# Altium project PCB_Project3.PrjPcb
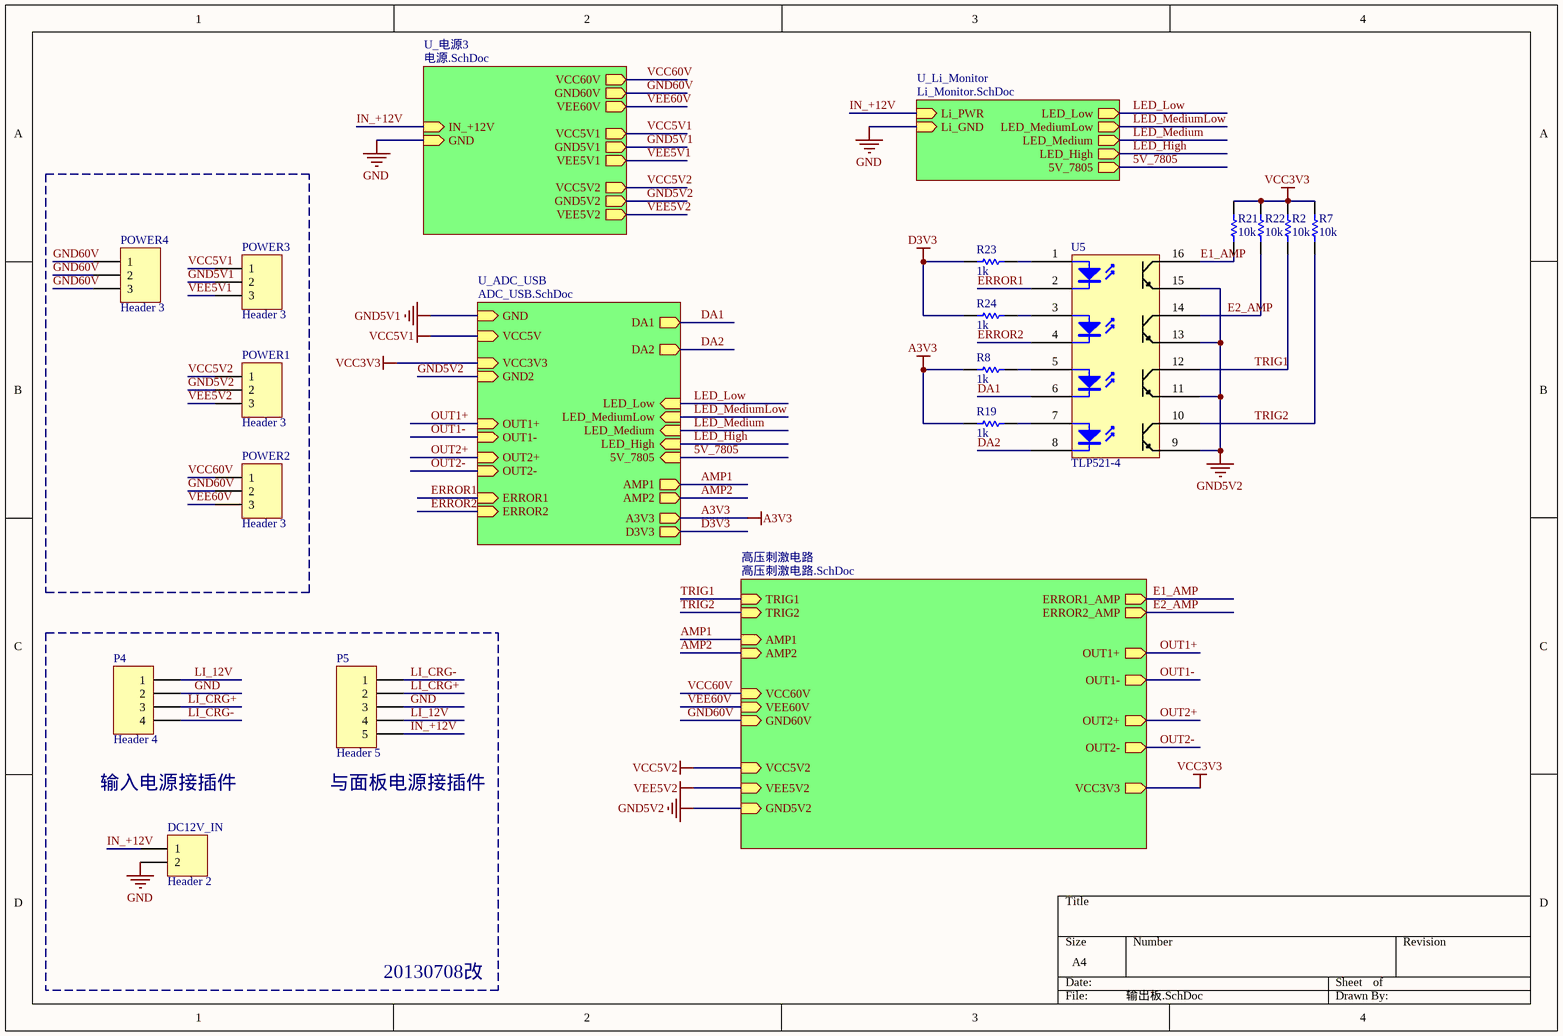
[diagram p0: 输出板.SchDoc]
5 sheets, 149 parts. Net scope: hierarchical (ports join the sheet entries above them; power ports are global).
Board file: MENB-C-H-DET-S-V1.2 2019.5.27.PcbDoc
Sheets:
  输出板.SchDoc
    高压刺激电路 = 高压刺激电路.SchDoc
    U_电源3 = 电源.SchDoc
    U_ADC_USB = ADC_USB.SchDoc
    U_Li_Monitor = Li_Monitor.SchDoc

## Sheet 输出板.SchDoc
size A4; Date: 2011.10.28; : 8通道刺激输出板; DrawnBy: Phoenix Joe; Engineer: Phoenix Joe; : 8通道刺激输出板

### Parts
(Parts that share a designator on the sheet are numbered #1, #2 ... from top to bottom, then left to right.)
DC12V_IN  Header 2  [HDR1X2]
P4  Header 4  [Power-4P]
P5  Header 5  [Power-5P]
POWER1  Header 3  [HDR1X3]
POWER2  Header 3  [HDR1X3]
POWER3  Header 3  [HDR1X3]
POWER4  Header 3  [HDR1X3]
R2  10k  [R0603]
R7  10k  [R0603]
R8  1k  [R0603]
R19  1k  [R0603]
R21  10k  [R0603]
R22  10k  [R0603]
R23  1k  [R0603]
R24  1k  [R0603]
U5#1  TLP521-4  [DIP-16]

### Sub-sheets
U_ADC_USB = ADC_USB.SchDoc: GND (in), VCC5V (in), DA1 (out), DA2 (out), OUT1+ (in), OUT1- (in), OUT2+ (in), OUT2- (in), LED_Low (in), LED_MediumLow (in), LED_Medium (in), LED_High (in), 5V_7805 (in), VCC3V3 (in), GND2 (in), AMP1 (out), AMP2 (out), A3V3 (out), ERROR1 (in), ERROR2 (in), D3V3 (out)
U_Li_Monitor = Li_Monitor.SchDoc: LED_Low (out), LED_MediumLow (out), LED_Medium (out), LED_High (out), 5V_7805 (out), Li_PWR (in), Li_GND (in)
U_电源3 = 电源.SchDoc: IN_+12V (in), VCC60V (out), VEE60V (out), VCC5V1 (out), VEE5V1 (out), GND60V (out), GND5V1 (out), VCC5V2 (out), VEE5V2 (out), GND5V2 (out), GND (in)
高压刺激电路 = 高压刺激电路.SchDoc: TRIG1 (in), VCC60V (in), VEE60V (in), GND60V (in), VCC5V2 (in), VEE5V2 (in), OUT1+ (out), GND5V2 (in), OUT1- (out), OUT2+ (out), OUT2- (out), TRIG2 (in), AMP1 (in), AMP2 (in), VCC3V3 (out), ERROR1_AMP (out), ERROR2_AMP (out)

### Nets
A3V3: R8.1 R19.1 ; sheet U_ADC_USB/A3V3
D3V3: R23.1 R24.1 ; sheet U_ADC_USB/D3V3
GND: DC12V_IN.2 P4.2 P5.3 POWER3.2 ; sheet U_电源3/GND5V1, sheet U_电源3/GND, sheet U_ADC_USB/GND, sheet U_Li_Monitor/Li_GND  [also labelled GND5V1]
GND5V2: POWER1.2 U5#1.9 U5#1.11 U5#1.13 U5#1.15 ; sheet 高压刺激电路/GND5V2, sheet U_电源3/GND5V2, sheet U_ADC_USB/GND2
GND60V: POWER2.2 POWER4.1 POWER4.2 POWER4.3 ; sheet 高压刺激电路/GND60V, sheet U_电源3/GND60V
IN_+12V: DC12V_IN.1 P5.5 ; sheet U_电源3/IN_+12V, sheet U_Li_Monitor/Li_PWR
VCC3V3: R2.1 R7.2 R21.1 R22.2 ; sheet 高压刺激电路/VCC3V3, sheet U_ADC_USB/VCC3V3  [project net 3.3V]
VCC5V1: POWER3.1 ; sheet U_电源3/VCC5V1, sheet U_ADC_USB/VCC5V
VCC5V2: POWER1.1 ; sheet 高压刺激电路/VCC5V2, sheet U_电源3/VCC5V2
VCC60V: POWER2.1 ; sheet 高压刺激电路/VCC60V, sheet U_电源3/VCC60V
VEE5V2: POWER1.3 ; sheet 高压刺激电路/VEE5V2, sheet U_电源3/VEE5V2
VEE60V: POWER2.3 ; sheet 高压刺激电路/VEE60V, sheet U_电源3/VEE60V
5V_7805: sheet U_ADC_USB/5V_7805, sheet U_Li_Monitor/5V_7805
AMP1: sheet 高压刺激电路/AMP1, sheet U_ADC_USB/AMP1  [project net AD1]
AMP2: sheet 高压刺激电路/AMP2, sheet U_ADC_USB/AMP2  [project net AD2]
DA1: U5#1.6 ; sheet U_ADC_USB/DA1  [project net 66]
DA2: U5#1.8 ; sheet U_ADC_USB/DA2  [project net 67]
E1_AMP: R21.2 U5#1.16 ; sheet 高压刺激电路/ERROR1_AMP
E2_AMP: R22.1 U5#1.14 ; sheet 高压刺激电路/ERROR2_AMP
ERROR1: U5#1.2 ; sheet U_ADC_USB/ERROR1  [project net 16]
ERROR2: U5#1.4 ; sheet U_ADC_USB/ERROR2  [project net 17]
LED_High: sheet U_ADC_USB/LED_High, sheet U_Li_Monitor/LED_High
LED_Low: sheet U_ADC_USB/LED_Low, sheet U_Li_Monitor/LED_Low
LED_Medium: sheet U_ADC_USB/LED_Medium, sheet U_Li_Monitor/LED_Medium
LED_MediumLow: sheet U_ADC_USB/LED_MediumLow, sheet U_Li_Monitor/LED_MediumLow
LI_12V: P4.1 P5.4
LI_CRG+: P4.3 P5.2
LI_CRG-: P4.4 P5.1
OUT1+: sheet 高压刺激电路/OUT1+, sheet U_ADC_USB/OUT1+
OUT1-: sheet 高压刺激电路/OUT1-, sheet U_ADC_USB/OUT1-
OUT2+: sheet 高压刺激电路/OUT2+, sheet U_ADC_USB/OUT2+
OUT2-: sheet 高压刺激电路/OUT2-, sheet U_ADC_USB/OUT2-
TRIG1: R2.2 U5#1.12 ; sheet 高压刺激电路/TRIG1  [project net INPUT_IN1]
TRIG2: R7.1 U5#1.10 ; sheet 高压刺激电路/TRIG2  [project net INPUT_IN2]
VEE5V1: POWER3.3 ; sheet U_电源3/VEE5V1
NetR8_2: R8.2 U5#1.5
NetR19_2: R19.2 U5#1.7
NetR23_2: R23.2 U5#1.1
NetR24_2: R24.2 U5#1.3

### Notes on the sheet
- 输入电源接插件
- (near P5) 与面板电源接插件
- 20130708改

### Library data of the parts
DC12V_IN = Header 2: Header, 2-Pin; LatestRevisionDate: 17-Jul-2002; LatestRevisionNote: Re-released for DXP Platform.; Publisher: Altium Limited
P4 = Header 4: Header, 4-Pin; LatestRevisionDate: 17-Jul-2002; LatestRevisionNote: Re-released for DXP Platform.; Publisher: Altium Limited
P5 = Header 5: Header, 5-Pin; LatestRevisionDate: 17-Jul-2002; LatestRevisionNote: Re-released for DXP Platform.; Publisher: Altium Limited
POWER1-POWER4 = Header 3: Header, 3-Pin; LatestRevisionDate: 17-Jul-2002; LatestRevisionNote: Re-released for DXP Platform.; Publisher: Altium Limited
R2 R7 R21 R22 = Res1: Resistor; Value: 1K; Published: 8-Jun-2000; LatestRevisionDate: 17-Jul-2002; LatestRevisionNote: Re-released for DXP Platform.; PackageReference: AXIAL-0.3; Publisher: Altium Limited; PackageDescription: Axial Device, Thru-Hole; 2 Leads; 0.3 in Pin Spacing
R8 R19 R23 R24 = Res1: Resistor; Published: 8-Jun-2000; LatestRevisionDate: 17-Jul-2002; LatestRevisionNote: Re-released for DXP Platform.; PackageReference: AXIAL-0.3; Publisher: Altium Limited; PackageDescription: Axial Device, Thru-Hole; 2 Leads; 0.3 in Pin Spacing
  R8 R23 R24: 15k: 1K
  R19: Value: 1K

## Sheet 高压刺激电路.SchDoc
size C
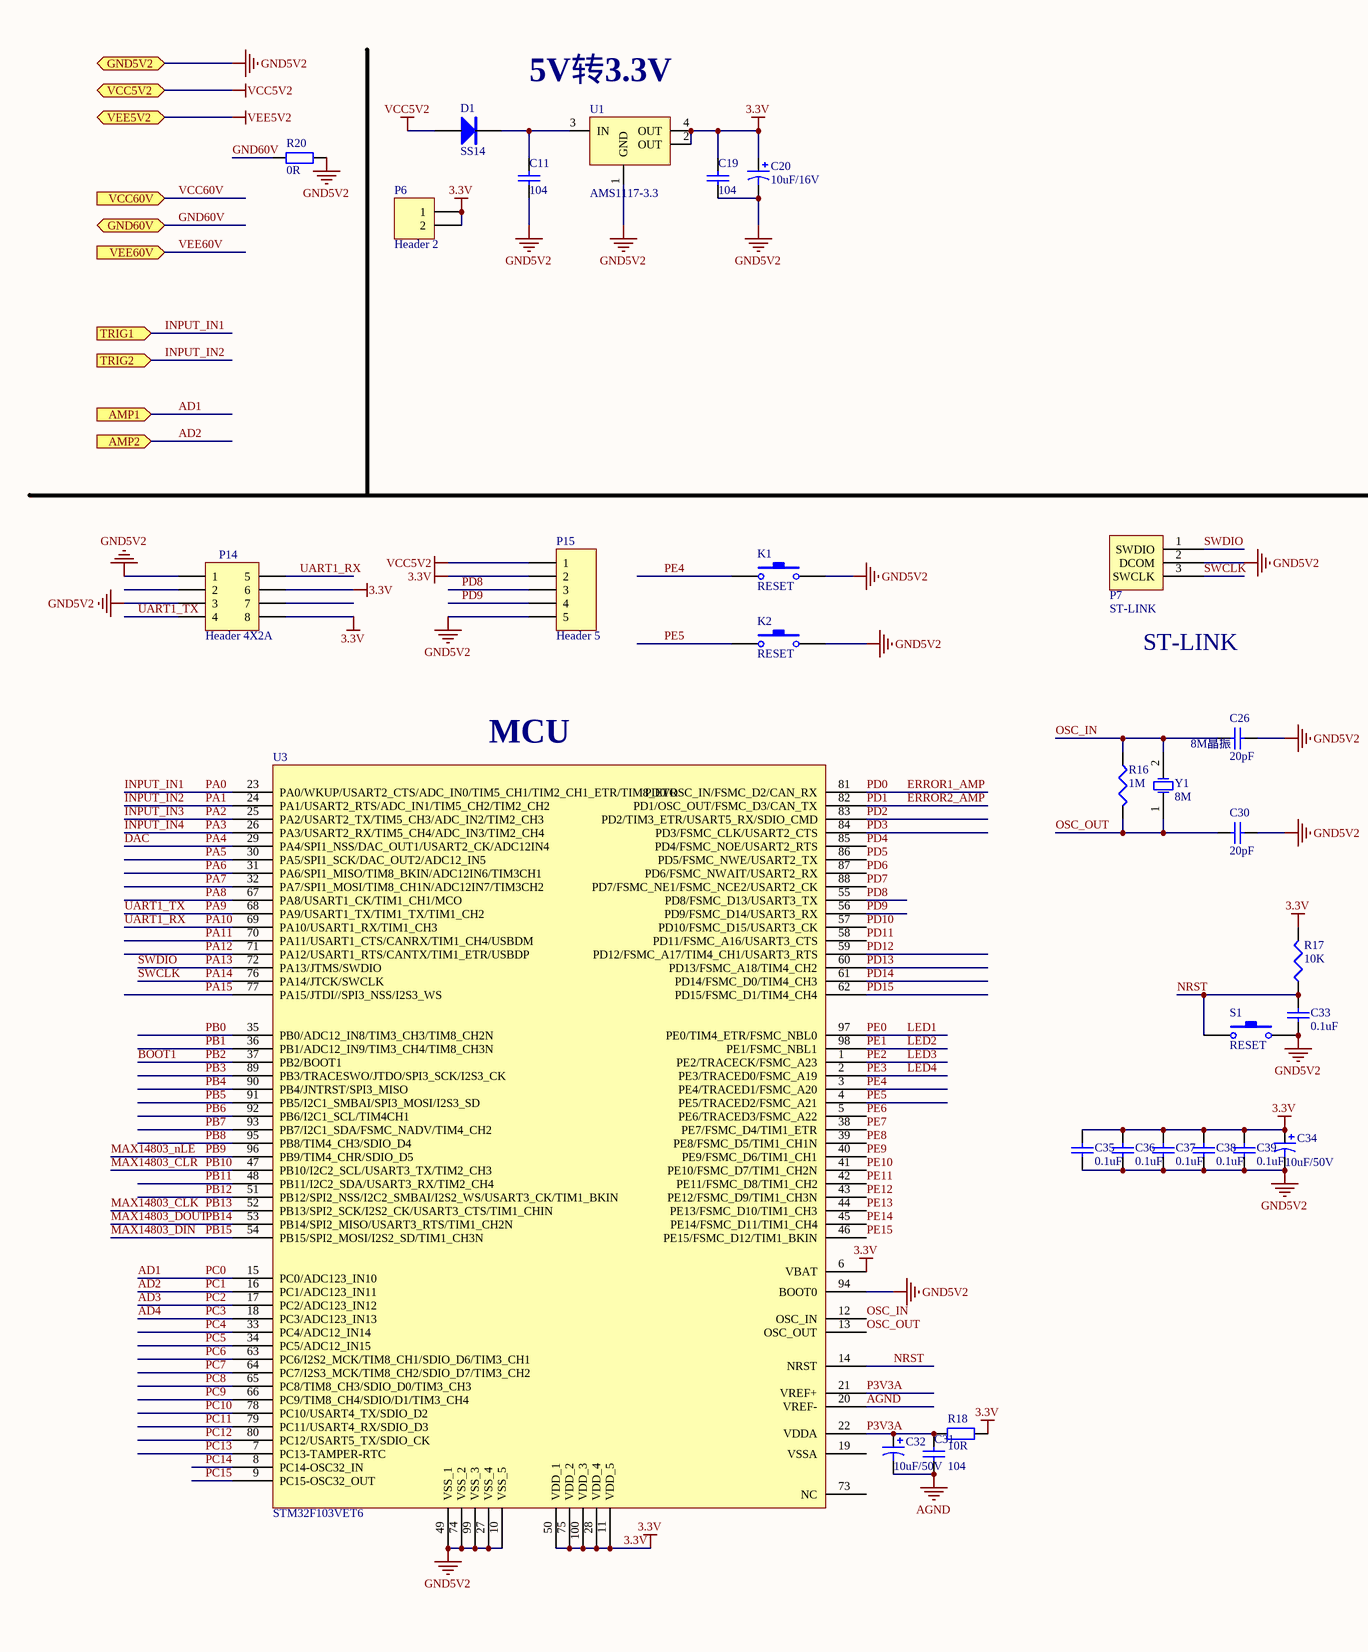
[diagram p1: 高压刺激电路.SchDoc, left]
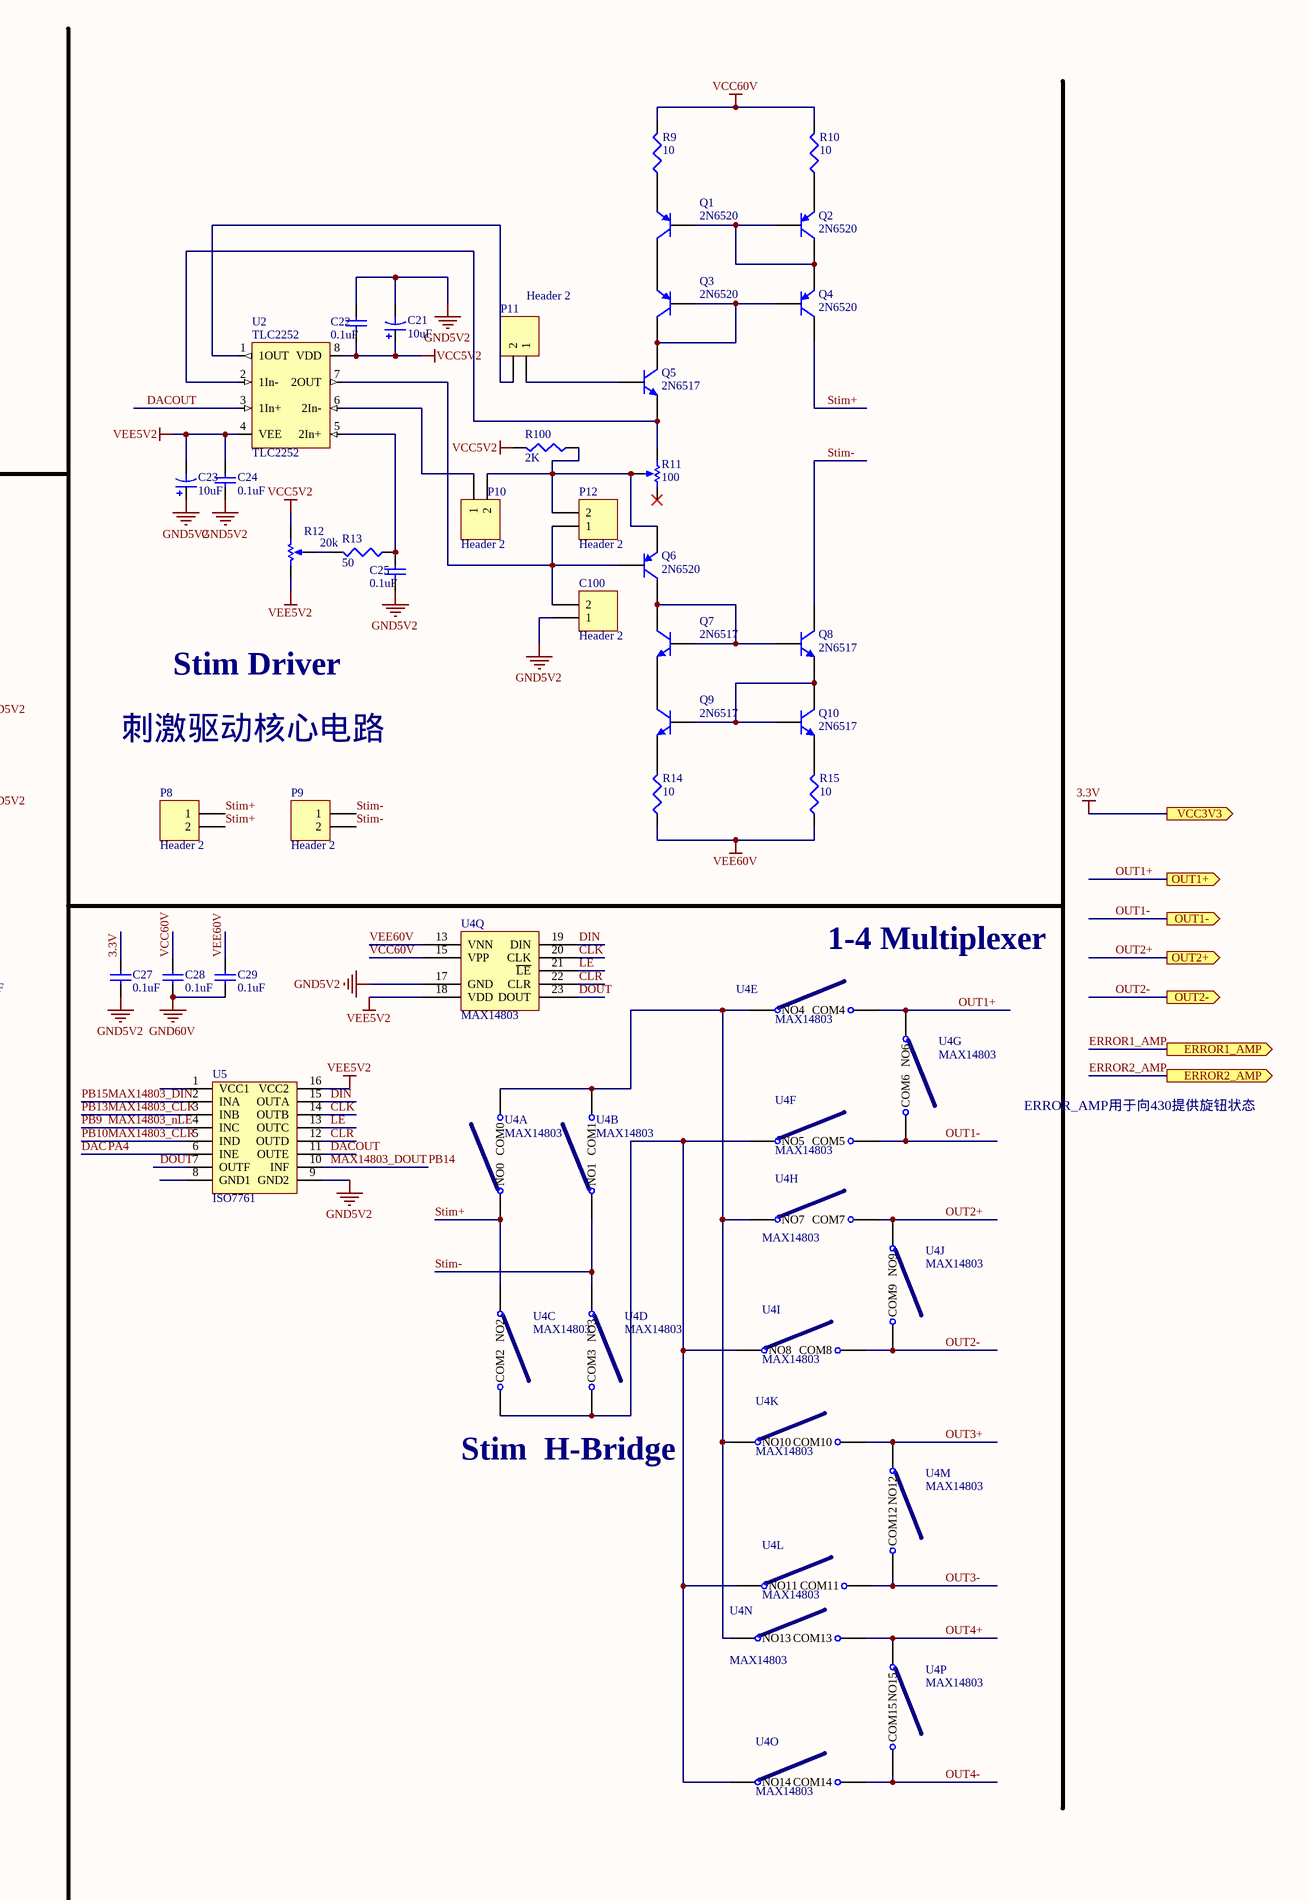
[diagram p2: 高压刺激电路.SchDoc, right]

### Parts
(Parts that share a designator on the sheet are numbered #1, #2 ... from top to bottom, then left to right.)
C11  104  [C0603]
C19  104  [C0603]
C20  10uF/16V  [C1206]
C21  value 10uF  [1206]  (hidden comment: Cap)
C22  0.1uF  [CC1608-0603]
C23  value 10uF  [1206]  (hidden comment: Cap)
C24  0.1uF  [CC1608-0603]
C25  0.1uF  [CC1608-0603]
C26  20pF  [C0603]
C27  0.1uF  [C0603]
C28  0.1uF  [C0603]
C29  0.1uF  [C0603]
C30  20pF  [C0603]
C31  104  [C0603]
C32  10uF/50V  [C0805]
C33  0.1uF  [C0603]
C34  10uF/50V  [C0805]
C35  0.1uF  [C0603]
C36  0.1uF  [C0603]
C37  0.1uF  [C0603]
C38  0.1uF  [C0603]
C39  0.1uF  [C0603]
C100  Header 2  [HDR1X2]
D1  SS14  [DO-214 SMA]
K1  RESET  [PCBComponent_1]
K2  RESET  [PCBComponent_1]
P6  Header 2  [HDR1X2]
P7  ST-LINK  [HDR1X3]
P8  Header 2  [HDR1X2]
P9  Header 2  [HDR1X2]
P10  Header 2  [HDR1X2]
P11  Header 2  [HDR1X2]
P12  Header 2  [HDR1X2]
P14  Header 4X2A  [HDR2X4_CEN]
P15  Header 5  [HDR1X5]
Q1  2N6520  [TO-92A]
Q2  2N6520  [TO-92A]
Q3  2N6520  [TO-92A]
Q4  2N6520  [TO-92A]
Q5  2N6517  [TO-92A]
Q6  2N6520  [TO-92A]
Q7  2N6517  [TO-92A]
Q8  2N6517  [TO-92A]
Q9  2N6517  [TO-92A]
Q10  2N6517  [TO-92A]
R9  value 10  [C1608-0603]  (hidden comment: Res3)
R10  value 10  [C1608-0603]  (hidden comment: Res3)
R11  100  [VR5]
R12  20k  [VR5]
R13  value 50  [C1608-0603]  (hidden comment: Res3)
R14  value 10  [C1608-0603]  (hidden comment: Res3)
R15  value 10  [C1608-0603]  (hidden comment: Res3)
R16  1M  [J1-0603]
R17  10K  [J1-0603]
R18  10R  [R0603]
R20  0R  [R0603]
R100  value 2K  [C1608-0603]  (hidden comment: Res3)
S1  RESET  [SWITCH]
U1  AMS1117-3.3  [SOT223-4M]
U2  TLC2252  [INA128_SO8]
U3  STM32F103VET6  [LQFP100]
U4  MAX14803  [TQFP48_N]  (parts A,B,C,D,E,F,G,H,I,J,K,L,M,N,O,P,Q of 17)
U5#2  ISO7761  [ISO7761]
Y1  8M  [BCY-W2/E4.7]

### Ports
AMP1 (in), AMP2 (in), ERROR1_AMP (out), ERROR2_AMP (out), GND5V2, GND60V, OUT1+ (out), OUT1- (out), OUT2+ (out), OUT2- (out), TRIG1 (in), TRIG2 (in), VCC3V3 (out), VCC5V2, VCC60V (in), VEE5V2, VEE60V (in)

### Nets
3.3V: C19.2 C20.1 C27.1 C34.1 C35.1 C36.1 C37.1 C38.1 C39.1 P6.1 P6.2 P14.6 P14.8 P15.2 R17.2 R18.1 U1.2(OUT) U1.4(OUT) U3.6(VBAT) U3.11(VDD_5) U3.28(VDD_4) U3.50(VDD_1) U3.75(VDD_2) U3.100(VDD_3) ; port VCC3V3
AGND: C31.1 C32.2 U3.20(VREF-)
GND5V2: C11.1 C19.1 C20.2 C21.2 C22.2 C23.1 C24.1 C25.1 C26.2 C27.2 C30.2 C33.1 C34.2 C35.2 C36.2 C37.2 C38.2 C39.2 C100.1 K1.2 K2.2 P7.2(DCOM) P14.1 P14.3 P15.5 R20.1 S1.2 U1.1(GND) U3.10(VSS_5) U3.27(VSS_4) U3.49(VSS_1) U3.74(VSS_2) U3.94(BOOT0) U3.99(VSS_3) U4.17(GND) U5#2.9(GND2) ; port GND5V2
GND60V: C28.2 C29.2 R20.2 ; port GND60V
VCC5V2: C21.1 C22.1 D1.A P15.1 R12.1(TOP) R100.2 U2.8(VDD) ; port VCC5V2
VCC60V: C28.1 R9.2 R10.2 U4.15(VPP) ; port VCC60V
VEE5V2: C23.2 C24.2 R12.3(BOT) U2.4(VEE) U4.18(VDD) U5#2.16(VCC2) ; port VEE5V2
VEE60V: C29.1 R14.1 R15.1 U4.13(VNN) ; port VEE60V
AD1: U3.15(PC0/ADC123_IN10) ; port AMP1  [also labelled PC0]
AD2: U3.16(PC1/ADC123_IN11) ; port AMP2  [also labelled PC1]
AD3: U3.17(PC2/ADC123_IN12)  [also labelled PC2]
AD4: U3.18(PC3/ADC123_IN13)  [also labelled PC3]
BOOT1: U3.37(PB2/BOOT1)  [also labelled PB2]
CLK: U4.20(CLK) U5#2.14(OUTB)
CLR: U4.22(CLR) U5#2.12(OUTD)
DAC: U3.29(PA4/SPI1_NSS/DAC_OUT1/USART2_CK/ADC12IN4) U5#2.6(INE)  [also labelled PA4]
DACOUT: U2.3(1In+) U5#2.11(OUTE)
DIN: U4.19(DIN) U5#2.15(OUTA)
DOUT: U4.23(DOUT) U5#2.7(OUTF)
ERROR1_AMP: U3.81(PD0/OSC_IN/FSMC_D2/CAN_RX) ; port ERROR1_AMP  [also labelled PD0]  [project net E1_AMP]
ERROR2_AMP: U3.82(PD1/OSC_OUT/FSMC_D3/CAN_TX) ; port ERROR2_AMP  [also labelled PD1]  [project net E2_AMP]
INPUT_IN1: U3.23(PA0/WKUP/USART2_CTS/ADC_IN0/TIM5_CH1/TIM2_CH1_ETR/TIM8_ETR) ; port TRIG1  [also labelled PA0]
INPUT_IN2: U3.24(PA1/USART2_RTS/ADC_IN1/TIM5_CH2/TIM2_CH2) ; port TRIG2  [also labelled PA1]
INPUT_IN3: U3.25(PA2/USART2_TX/TIM5_CH3/ADC_IN2/TIM2_CH3)  [also labelled PA2]
INPUT_IN4: U3.26(PA3/USART2_RX/TIM5_CH4/ADC_IN3/TIM2_CH4)  [also labelled PA3]
LE: U4.21(~{LE}) U5#2.13(OUTC)
LED1: U3.97(PE0/TIM4_ETR/FSMC_NBL0)  [also labelled PE0]
LED2: U3.98(PE1/FSMC_NBL1)  [also labelled PE1]
LED3: U3.1(PE2/TRACECK/FSMC_A23)  [also labelled PE2]
LED4: U3.2(PE3/TRACED0/FSMC_A19)  [also labelled PE3]
MAX14803_CLK: U3.52(PB13/SPI2_SCK/I2S2_CK/USART3_CTS/TIM1_CHIN) U5#2.3(INB)  [also labelled PB13]
MAX14803_CLR: U3.47(PB10/I2C2_SCL/USART3_TX/TIM2_CH3) U5#2.5(IND)  [also labelled PB10]
MAX14803_DIN: U3.54(PB15/SPI2_MOSI/I2S2_SD/TIM1_CH3N) U5#2.2(INA)  [also labelled PB15]
MAX14803_DOUT: U3.53(PB14/SPI2_MISO/USART3_RTS/TIM1_CH2N) U5#2.10(INF)  [also labelled PB14]
MAX14803_nLE: U3.96(PB9/TIM4_CHR/SDIO_D5) U5#2.4(INC)  [also labelled PB9]
NRST: C33.2 R17.1 S1.1 U3.14(NRST)
OSC_IN: C26.1 R16.2 U3.12(OSC_IN) Y1.2(OSC2)
OSC_OUT: C30.1 R16.1 U3.13(OSC_OUT) Y1.1(OSC1)
OUT1+: U4.3(COM4) U4.45(NO6) ; port OUT1+
OUT1-: U4.46(COM6) U4.48(COM5) ; port OUT1-
OUT2+: U4.40(NO9) U4.44(COM7) ; port OUT2+
OUT2-: U4.39(COM9) U4.41(COM8) ; port OUT2-
OUT3+: U4.32(NO12) U4.37(COM10)
OUT3-: U4.31(COM12) U4.34(COM11)
OUT4+: U4.26(NO15) U4.29(COM13)
OUT4-: U4.25(COM15) U4.28(COM14)
P3V3A: C31.2 C32.1 R18.2 U3.21(VREF+) U3.22(VDDA)
PA5: U3.30(PA5/SPI1_SCK/DAC_OUT2/ADC12_IN5)
PA6: U3.31(PA6/SPI1_MISO/TIM8_BKIN/ADC12IN6/TIM3CH1)
PA7: U3.32(PA7/SPI1_MOSI/TIM8_CH1N/ADC12IN7/TIM3CH2)
PA8: U3.67(PA8/USART1_CK/TIM1_CH1/MCO)
PA9: P14.4 U3.68(PA9/USART1_TX/TIM1_TX/TIM1_CH2)  [also labelled UART1_TX]
PA10: P14.5 U3.69(PA10/USART1_RX/TIM1_CH3)  [also labelled UART1_RX]
PA11: U3.70(PA11/USART1_CTS/CANRX/TIM1_CH4/USBDM)
PA12: U3.71(PA12/USART1_RTS/CANTX/TIM1_ETR/USBDP)
PA13: P7.1(SWDIO) U3.72(PA13/JTMS/SWDIO)  [also labelled SWDIO]
PA14: P7.3(SWCLK) U3.76(PA14/JTCK/SWCLK)  [also labelled SWCLK]
PA15: U3.77(PA15/JTDI//SPI3_NSS/I2S3_WS)
PB0: U3.35(PB0/ADC12_IN8/TIM3_CH3/TIM8_CH2N)
PB1: U3.36(PB1/ADC12_IN9/TIM3_CH4/TIM8_CH3N)
PB3: U3.89(PB3/TRACESWO/JTDO/SPI3_SCK/I2S3_CK)
PB4: U3.90(PB4/JNTRST/SPI3_MISO)
PB5: U3.91(PB5/I2C1_SMBAI/SPI3_MOSI/I2S3_SD)
PB6: U3.92(PB6/I2C1_SCL/TIM4CH1)
PB7: U3.93(PB7/I2C1_SDA/FSMC_NADV/TIM4_CH2)
PB8: U3.95(PB8/TIM4_CH3/SDIO_D4)
PB11: U3.48(PB11/I2C2_SDA/USART3_RX/TIM2_CH4)
PB12: U3.51(PB12/SPI2_NSS/I2C2_SMBAI/I2S2_WS/USART3_CK/TIM1_BKIN)
PC4: U3.33(PC4/ADC12_IN14)
PC5: U3.34(PC5/ADC12_IN15)
PC6: U3.63(PC6/I2S2_MCK/TIM8_CH1/SDIO_D6/TIM3_CH1)
PC7: U3.64(PC7/I2S3_MCK/TIM8_CH2/SDIO_D7/TIM3_CH2)
PC8: U3.65(PC8/TIM8_CH3/SDIO_D0/TIM3_CH3)
PC9: U3.66(PC9/TIM8_CH4/SDIO/D1/TIM3_CH4)
PC10: U3.78(PC10/USART4_TX/SDIO_D2)
PC11: U3.79(PC11/USART4_RX/SDIO_D3)
PC12: U3.80(PC12/USART5_TX/SDIO_CK)
PC13: U3.7(PC13-TAMPER-RTC)
PC14: U3.8(PC14-OSC32_IN)
PC15: U3.9(PC15-OSC32_OUT)
PD2: U3.83(PD2/TIM3_ETR/USART5_RX/SDIO_CMD)
PD3: U3.84(PD3/FSMC_CLK/USART2_CTS)
PD4: U3.85(PD4/FSMC_NOE/USART2_RTS)
PD5: U3.86(PD5/FSMC_NWE/USART2_TX)
PD6: U3.87(PD6/FSMC_NWAIT/USART2_RX)
PD7: U3.88(PD7/FSMC_NE1/FSMC_NCE2/USART2_CK)
PD8: P15.3 U3.55(PD8/FSMC_D13/USART3_TX)
PD9: P15.4 U3.56(PD9/FSMC_D14/USART3_RX)
PD10: U3.57(PD10/FSMC_D15/USART3_CK)
PD11: U3.58(PD11/FSMC_A16/USART3_CTS)
PD12: U3.59(PD12/FSMC_A17/TIM4_CH1/USART3_RTS)
PD13: U3.60(PD13/FSMC_A18/TIM4_CH2)
PD14: U3.61(PD14/FSMC_D0/TIM4_CH3)
PD15: U3.62(PD15/FSMC_D1/TIM4_CH4)
PE4: K1.1 U3.3(PE4/TRACED1/FSMC_A20)
PE5: K2.1 U3.4(PE5/TRACED2/FSMC_A21)
PE6: U3.5(PE6/TRACED3/FSMC_A22)
PE7: U3.38(PE7/FSMC_D4/TIM1_ETR)
PE8: U3.39(PE8/FSMC_D5/TIM1_CH1N)
PE9: U3.40(PE9/FSMC_D6/TIM1_CH1)
PE10: U3.41(PE10/FSMC_D7/TIM1_CH2N)
PE11: U3.42(PE11/FSMC_D8/TIM1_CH2)
PE12: U3.43(PE12/FSMC_D9/TIM1_CH3N)
PE13: U3.44(PE13/FSMC_D10/TIM1_CH3)
PE14: U3.45(PE14/FSMC_D11/TIM1_CH4)
PE15: U3.46(PE15/FSMC_D12/TIM1_BKIN)
Stim+: P8.1 P8.2 Q4.3(C) U4.7(NO2) U4.11(NO0)
Stim-: P9.1 P9.2 Q8.3(C) U4.5(NO3) U4.10(NO1)
NetC11_2: C11.2 D1.K U1.3(IN)
NetC25_2: C25.2 R13.1 U2.5(2In+)
NetC100_2: C100.2 P12.1 Q6.2(B) U2.7(2OUT)
NetP10_1: P10.1 U2.6(2In-)
NetP10_2: P10.2 P12.2 Q6.1(E) R11.2(TAP) R100.1
NetP11_1: P11.1 Q5.2(B)
NetP11_2: P11.2 U2.1(1OUT)
NetQ1_1: Q1.1(E) R9.1
NetQ1_2: Q1.2(B) Q2.2(B) Q2.3(C) Q4.1(E)
NetQ1_3: Q1.3(C) Q3.1(E)
NetQ2_1: Q2.1(E) R10.1
NetQ3_2: Q3.2(B) Q3.3(C) Q4.2(B) Q5.3(C)
NetQ5_1: Q5.1(E) R11.1(TOP) U2.2(1In-)
NetQ6_3: Q6.3(C) Q7.2(B) Q7.3(C) Q8.2(B)
NetQ7_1: Q7.1(E) Q9.3(C)
NetQ8_1: Q8.1(E) Q9.2(B) Q10.2(B) Q10.3(C)
NetQ9_1: Q9.1(E) R14.2
NetQ10_1: Q10.1(E) R15.2
NetR12_2: R12.2(TAP) R13.2
NetU4_4: U4.4(NO4) U4.9(COM1) U4.12(COM0) U4.30(NO13) U4.38(NO10) U4.43(NO7)
NetU4_6: U4.6(COM3) U4.8(COM2) U4.27(NO14) U4.33(NO11) U4.42(NO8) U4.47(NO5)

Not connected (* = marked no-connect by the designer): P14 2 7; R11 3(BOT)*; U3 19(VSSA) 73(NC); U5#2 1(VCC1) 8(GND1)

### Notes on the sheet
- (near U1) 5V转3.3V
- ST-LINK
- (near U3) MCU
- 8M晶振
- Stim Driver
- 刺激驱动核心电路
- 1-4 Multiplexer
- ERROR_AMP用于向430提供旋钮状态
- (near U4) Stim  H-Bridge

### Library data of the parts
C11 C19 C22 C24-C31 C33 C35-C39 = Cap Semi: Capacitor (Semiconductor SIM Model); Published: 8-Jun-2000; Publisher: Altium Limited
  C11 C19 C31: LatestRevisionDate: 29-May-2009; LatestRevisionNote: IPC-7351 Footprint Added.; PackageReference: C1206; PackageDescription: Chip Capacitor; Value: 104
  C22 C24 C25: Revision: July-2002: Re-released for DXP Platform.; Value: 0.1uF
  C26 C30: LatestRevisionDate: 29-May-2009; LatestRevisionNote: IPC-7351 Footprint Added.; PackageReference: C1206; PackageDescription: Chip Capacitor; Value: 20pF
  C27-C29 C33 C35-C39: LatestRevisionDate: 29-May-2009; LatestRevisionNote: IPC-7351 Footprint Added.; PackageReference: C1206; PackageDescription: Chip Capacitor; Value: 0.1uF
C20 C21 C23 = Cap Pol1: Polarized Capacitor (Radial); Published: 8-Jun-2000; LatestRevisionDate: 17-Jul-2002; LatestRevisionNote: Re-released for DXP Platform.; PackageReference: RB7.6-15; Publisher: Altium Limited
  C20: PackageDescription: Polarized Capacitor (Radial); 2 Leads; Value: 10uF/16V
C32 C34 = Cap Pol3: Polarized Capacitor (Surface Mount); Value: 10uF/16V; Published: 8-Jun-2000; LatestRevisionDate: 29-May-2009; LatestRevisionNote: IPC-7351 Footprint Added.; PackageReference: C0805; Publisher: Altium Limited; PackageDescription: Chip Capacitor
C100 P6 P8-P12 = Header 2: Header, 2-Pin; LatestRevisionDate: 17-Jul-2002; LatestRevisionNote: Re-released for DXP Platform.; Publisher: Altium Limited
D1 = Diode: 1.0 Ampere Schottky Barrier Rectifiers
K1 K2 = SW-PB: Switch-按键; Published: 24-Mar-1999; LatestRevisionDate: 17-Jul-2002; LatestRevisionNote: Re-released for DXP Platform.; PackageReference: SPST-2; Publisher: Altium Limited; PackageDescription: Switch; 2 Leads
P14 = Header 4X2A: Header, 4-Pin, Dual row; LatestRevisionDate: 17-Jul-2002; LatestRevisionNote: Re-released for DXP Platform.; Publisher: Altium Limited
P15 = Header 5: Header, 5-Pin; LatestRevisionDate: 17-Jul-2002; LatestRevisionNote: Re-released for DXP Platform.; Publisher: Altium Limited
Q1-Q4 Q6 = 2N3906: PNP General Purpose Amplifier; Published: 8-Jun-2000; LatestRevisionDate: 15-Jan-2003; LatestRevisionNote: PCB Footprint 'BCY-W3/D4.7' replaced; DatasheetDocument: 1997; PackageDocument: Sep-1998; PackageReference: TO-92A; Publisher: Altium Limited; Code_JEDEC: TO-92A; ComponentLink1Description: Manufacturer Link; ComponentLink1URL: http://www.fairchildsemi.com/; ComponentLink2Description: Datasheet; ComponentLink2URL: http://www.fairchildsemi.com/ds/2N%2F2N3906.pdf
Q5 Q7-Q10 = 2N3904: NPN General Purpose Amplifier; Published: 8-Jun-2000; LatestRevisionDate: 15-Jan-2003; LatestRevisionNote: PCB Footprint 'BCY-W3/D4.7' replaced; DatasheetDocument: 1997; PackageDocument: Sep-1998; PackageReference: TO-92A; Publisher: Altium Limited; Code_JEDEC: TO-92A; ComponentLink1Description: Manufacturer Link; ComponentLink1URL: http://www.fairchildsemi.com/; ComponentLink2Description: Datasheet; ComponentLink2URL: http://www.fairchildsemi.com/ds/2N%2F2N3904.pdf
R9 R10 R13-R17 R100 = Res3: Resistor; Published: 8-Jun-2000; Publisher: Altium Limited
  R9 R10 R13-R15 R100: Revision: July-2002: Re-released for DXP Platform.
  R16: LatestRevisionDate: 29-May-2009; LatestRevisionNote: IPC-7351 Footprint Added.; PackageReference: J1-0603; PackageDescription: Chip Resistor; Value: 1M
  R17: LatestRevisionDate: 29-May-2009; LatestRevisionNote: IPC-7351 Footprint Added.; PackageReference: J1-0603; PackageDescription: Chip Resistor; Value: 10K
R11 R12 = ResVari
R18 R20 = Res2: Resistor; Value: 1K; Published: 8-Jun-2000; LatestRevisionDate: 17-Jul-2002; LatestRevisionNote: Re-released for DXP Platform.; PackageReference: AXIAL-0.4; Publisher: Altium Limited; PackageDescription: Axial Device, Thru-Hole; 2 Leads; 0.4 in Pin Spacing
S1 = SW-PB: Switch-按键; pin to pad: 2>4; Published: 24-Mar-1999; LatestRevisionDate: 17-Jul-2002; LatestRevisionNote: Re-released for DXP Platform.; PackageReference: SPST-2; Publisher: Altium Limited; PackageDescription: Switch; 2 Leads
U1 = AMS1117
U5#2 = ISO776X
Y1 = XTAL: Crystal Oscillator; Published: 8-Jun-2000; LatestRevisionDate: 17-Jul-2002; LatestRevisionNote: Re-released for DXP Platform.; PackageReference: R38; Publisher: Altium Limited; PackageDescription: Crystal, Thru-Hole; 2 Leads; Body 3.1 x 8.2 mm (Dia.xH)

## Sheet 电源.SchDoc
size A4
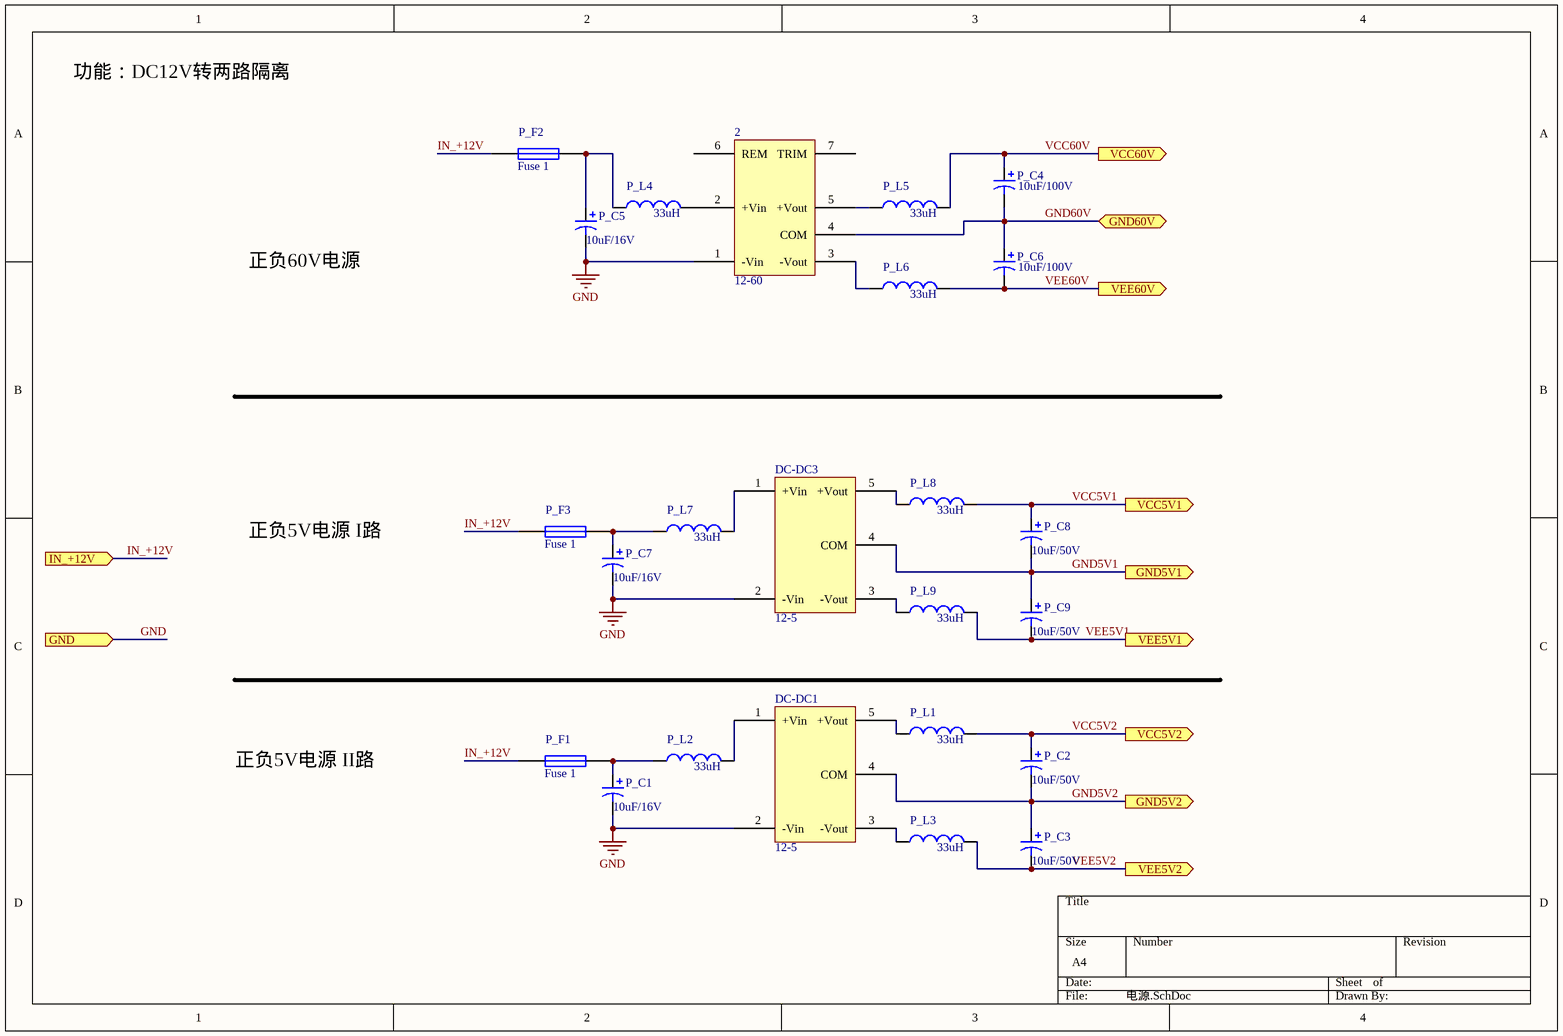
[diagram p3: 电源.SchDoc]

### Parts
2  12-60  [12-60]
DC-DC1  12-5  [12-5]
DC-DC3  12-5  [12-5]
P_C1  value 10uF/16V  [cap_2.54]  (hidden comment: Cap Pol3)
P_C2  value 10uF/50V  [cap_2.54]  (hidden comment: Cap Pol3)
P_C3  value 10uF/50V  [cap_2.54]  (hidden comment: Cap Pol3)
P_C4  10uF/100V  [cap_2.54]
P_C5  value 10uF/16V  [cap_2.54]  (hidden comment: Cap Pol3)
P_C6  10uF/100V  [cap_2.54]
P_C7  value 10uF/16V  [cap_2.54]  (hidden comment: Cap Pol3)
P_C8  value 10uF/50V  [cap_2.54]  (hidden comment: Cap Pol3)
P_C9  value 10uF/50V  [cap_2.54]  (hidden comment: Cap Pol3)
P_F1  Fuse 1  [HDR1X2]
P_F2  Fuse 1  [HDR1X2]
P_F3  Fuse 1  [HDR1X2]
P_L1  value 33uH  [AXIAL-0.4]  (hidden comment: Inductor)
P_L2  value 33uH  [AXIAL-0.4]  (hidden comment: Inductor)
P_L3  value 33uH  [AXIAL-0.4]  (hidden comment: Inductor)
P_L4  value 33uH  [AXIAL-0.4]  (hidden comment: Inductor)
P_L5  value 33uH  [AXIAL-0.4]  (hidden comment: Inductor)
P_L6  value 33uH  [AXIAL-0.4]  (hidden comment: Inductor)
P_L7  value 33uH  [AXIAL-0.4]  (hidden comment: Inductor)
P_L8  value 33uH  [AXIAL-0.4]  (hidden comment: Inductor)
P_L9  value 33uH  [AXIAL-0.4]  (hidden comment: Inductor)

### Ports
GND5V1 (out), GND5V2 (out), GND60V, GND (in), IN_+12V (in), VCC5V1 (out), VCC5V2 (out), VCC60V, VEE5V1 (out), VEE5V2 (out), VEE60V

### Nets
GND: 2.1(-Vin) DC-DC1.2(-Vin) DC-DC3.2(-Vin) DC-DC3.4(COM) P_C1.2 P_C5.2 P_C7.2 P_C8.2 P_C9.1 ; port GND5V1, port GND  [also labelled GND5V1]
GND5V2: DC-DC1.4(COM) P_C2.2 P_C3.1 ; port GND5V2
GND60V: 2.4(COM) P_C4.2 P_C6.1 ; port GND60V
IN_+12V: P_F1.1 P_F2.1 P_F3.1 ; port IN_+12V
VCC5V1: P_C8.1 P_L8.2 ; port VCC5V1
VCC5V2: P_C2.1 P_L1.2 ; port VCC5V2
VCC60V: P_C4.1 P_L5.2 ; port VCC60V
VEE5V2: P_C3.2 P_L3.2 ; port VEE5V2
VEE60V: P_C6.2 P_L6.2 ; port VEE60V
VEE5V1: P_C9.2 P_L9.2 ; port VEE5V1
Net2_2: 2.2(+Vin) P_L4.2
Net2_3: 2.3(-Vout) P_L6.1
Net2_5: 2.5(+Vout) P_L5.1
NetDC-DC1_1: DC-DC1.1(+Vin) P_L2.2
NetDC-DC1_3: DC-DC1.3(-Vout) P_L3.1
NetDC-DC1_5: DC-DC1.5(+Vout) P_L1.1
NetDC-DC3_1: DC-DC3.1(+Vin) P_L7.2
NetDC-DC3_3: DC-DC3.3(-Vout) P_L9.1
NetDC-DC3_5: DC-DC3.5(+Vout) P_L8.1
NetP_C1_1: P_C1.1 P_F1.2 P_L2.1
NetP_C5_1: P_C5.1 P_F2.2 P_L4.1
NetP_C7_1: P_C7.1 P_F3.2 P_L7.1

Not connected (* = marked no-connect by the designer): 2 6(REM) 7(TRIM)

### Notes on the sheet
- 功能：DC12V转两路隔离
- 正负60V电源
- 正负5V电源 I路
- 正负5V电源 II路

### Library data of the parts
P_C1-P_C3 P_C5 P_C7-P_C9 = Cap Pol3: Polarized Capacitor (Surface Mount); Published: 8-Jun-2000; LatestRevisionDate: 29-May-2009; LatestRevisionNote: IPC-7351 Footprint Added.; PackageReference: C0805; Publisher: Altium Limited; PackageDescription: Chip Capacitor
P_C4 P_C6 = Cap Pol3: Polarized Capacitor (Surface Mount); Value: 10uF/50V; Published: 8-Jun-2000; LatestRevisionDate: 29-May-2009; LatestRevisionNote: IPC-7351 Footprint Added.; PackageReference: C0805; Publisher: Altium Limited; PackageDescription: Chip Capacitor
P_F1-P_F3 = Fuse 1: Fuse; Published: 8-Jun-2000; LatestRevisionDate: 17-Jul-2002; LatestRevisionNote: Re-released for DXP Platform.; PackageReference: PIN-W2/E2.8; Publisher: Altium Limited; PackageDescription: Thru-Hole; 2 Leads
P_L1-P_L9 = Inductor: Code_IEC: 1005; Published: 8-Jun-2000; LatestRevisionDate: 29-May-2009; LatestRevisionNote: IPC-7351 Footprint Added.; PackageReference: 0402-A; Publisher: Altium Limited; PackageDescription: Chip Inductor; Code_JEITA: 0402

## Sheet ADC_USB.SchDoc
size A4
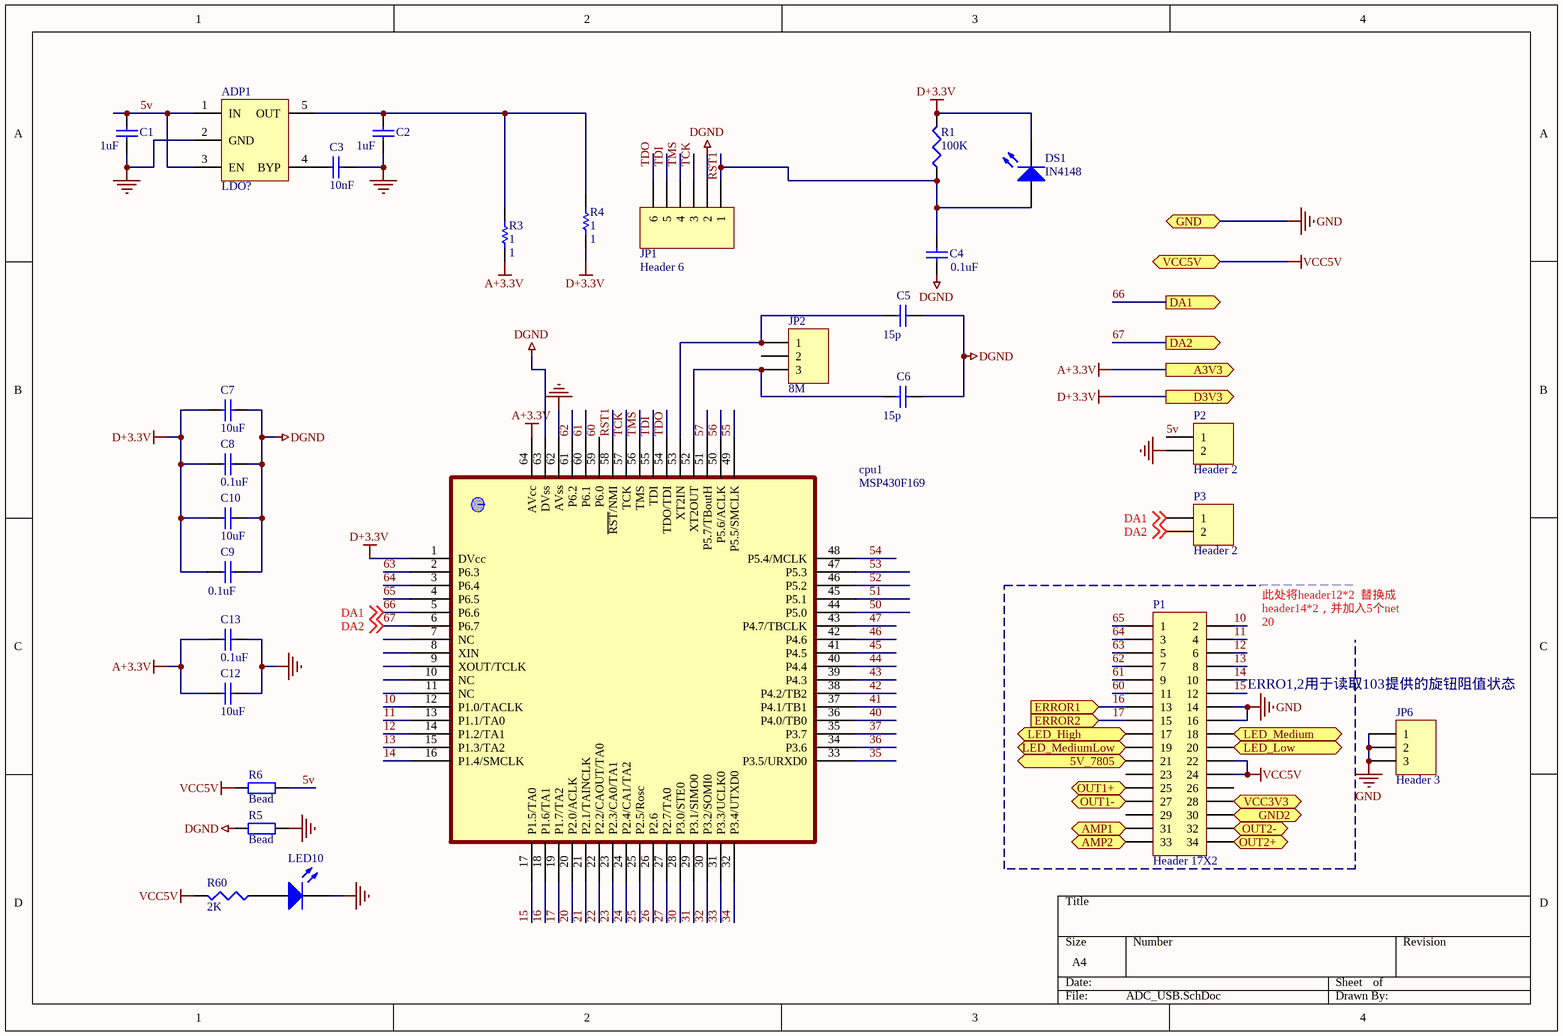
[diagram p4: ADC_USB.SchDoc]

### Parts
ADP1  LDO?  [ADP1711_3v3]
C1  value 1uF  [CC1608-0603]  (hidden comment: 1u)
C2  value 1uF  [CC1608-0603]  (hidden comment: 1u)
C3  value 10nF  [CC1608-0603]  (hidden comment: 10n)
C4  0.1uF  [CC1608-0603]
C5  15p  [CC1608-0603]
C6  15p  [CC1608-0603]
C7  10uF  [CC3216-1206]
C8  value 0.1uF  [CC1608-0603]  (hidden comment: Cap Semi)
C9  0.1uF  [CC1608-0603]
C10  10uF  [CC3216-1206]
C12  10uF  [CC3216-1206]
C13  0.1uF  [CC1608-0603]
cpu1  MSP430F169  [msp430f149]
DS1  IN4148  [SMD _LED]
JP1  Header 6  [HDR1X6]
JP2  8M  [HDR1X3]
JP6  Header 3  [HDR1X3]
LED10  LED  [6-0805_M]  (value not drawn)
P1  Header 17X2  [HDR2X17-NIUJIAO]
P2  Header 2  [HDR1X2]
P3  Header 2  [HDR1X2]
R1  100K  [C1608-0603]
R3  1  [6-0805_M]
R4  1  [6-0805_M]
R5  Bead  [6-0805_M]
R6  Bead  [6-0805_M]
R60  2K  [1608[0603]]

### Blocks framed on the sheet
ERRO1,2用于读取103提供的旋钮阻值状态: P1

### Ports
5V_7805 (in), A3V3 (out), AMP1, AMP2, D3V3 (out), DA1 (out), DA2 (out), ERROR1 (in), ERROR2 (in), GND, GND2 (in), LED_High (in), LED_Low (in), LED_Medium (in), LED_MediumLow (in), OUT1+ (in), OUT1- (in), OUT2+ (in), OUT2- (in), VCC3V3 (in), VCC5V

### Nets
3.3V: P1.28 ; port VCC3V3
A+3.3V: C12.2 C13.2 cpu1.64(AVcc) R3.1 ; port A3V3  [project net A3V3]
D+3.3V: C7.2 C8.2 C9.2 C10.2 cpu1.1(DVcc) DS1.2(K) R1.2 R4.1 ; port D3V3  [project net D3V3]
DGND: C4.1 C5.1 C6.1 C7.1 C8.1 C9.1 C10.1 cpu1.63(DVss) JP1.2 R5.1
GND: ADP1.2(GND) C1.2 C2.2 C3.2 C12.1 C13.1 cpu1.62(AVss) JP6.1 JP6.2 JP6.3 LED10.2(K) P1.14 P1.16 P2.2 R5.2 ; port GND
GND5V2: P1.30 ; port GND2
VCC5V: P1.22 P1.24 R6.2 R60.2 ; port VCC5V  [project net VCC5V1]
5v: ADP1.1(IN) ADP1.3(EN) C1.1 P2.1 R6.1
5V_7805: P1.21 ; port 5V_7805
10: cpu1.12(P1.0/TACLK) P1.2
11: cpu1.13(P1.1/TA0) P1.4
12: cpu1.14(P1.2/TA1) P1.6
13: cpu1.15(P1.3/TA2) P1.8
14: cpu1.16(P1.4/SMCLK) P1.10
15: cpu1.17(P1.5/TA0) P1.12
16: cpu1.18(P1.6/TA1) P1.13 ; port ERROR1
17: cpu1.19(P1.7/TA2) P1.15 ; port ERROR2
20: cpu1.20(P2.0/ACLK)
21: cpu1.21(P2.1/TAINCLK)
22: cpu1.22(P2.2/CAOUT/TA0)
23: cpu1.23(P2.3/CA0/TA1)
24: cpu1.24(P2.4/CA1/TA2)
25: cpu1.25(P2.5/Rosc)
26: cpu1.26(P2.6)
27: cpu1.27(P2.7/TA0)
30: cpu1.28(P3.0/STE0)
31: cpu1.29(P3.1/SIMO0)
32: cpu1.30(P3.2/SOMI0)
33: cpu1.31(P3.3/UCLK0)
34: cpu1.32(P3.4/UTXD0)
35: cpu1.33(P3.5/URXD0)
36: cpu1.34(P3.6)
37: cpu1.35(P3.7)
40: cpu1.36(P4.0/TB0)
41: cpu1.37(P4.1/TB1)
42: cpu1.38(P4.2/TB2)
43: cpu1.39(P4.3)
44: cpu1.40(P4.4)
45: cpu1.41(P4.5)
46: cpu1.42(P4.6)
47: cpu1.43(P4.7/TBCLK)
50: cpu1.44(P5.0)
51: cpu1.45(P5.1)
52: cpu1.46(P5.2)
53: cpu1.47(P5.3)
54: cpu1.48(P5.4/MCLK)
55: cpu1.49(P5.5/SMCLK)
56: cpu1.50(P5.6/ACLK)
57: cpu1.51(P5.7/TBoutH)
60: cpu1.59(P6.0) P1.11
61: cpu1.60(P6.1) P1.9
62: cpu1.61(P6.2) P1.7
63: cpu1.2(P6.3) P1.5
64: cpu1.3(P6.4) P1.3
65: cpu1.4(P6.5) P1.1
66: cpu1.5(P6.6) P3.1 ; off-sheet DA1, port DA1  [also labelled DA1]
67: cpu1.6(P6.7) P3.2 ; off-sheet DA2, port DA2  [also labelled DA2]
AD1: P1.31 ; port AMP1
AD2: P1.33 ; port AMP2
LED_High: P1.17 ; port LED_High
LED_Low: P1.20 ; port LED_Low
LED_Medium: P1.18 ; port LED_Medium
LED_MediumLow: P1.19 ; port LED_MediumLow
OUT1+: P1.25 ; port OUT1+
OUT1-: P1.27 ; port OUT1-
OUT2+: P1.34 ; port OUT2+
OUT2-: P1.32 ; port OUT2-
RST1: C4.2 cpu1.58(~{RST}/NMI) DS1.1(A) JP1.1 R1.1
TCK: cpu1.57(TCK) JP1.3
TDI: cpu1.55(TDI) JP1.5
TDO: cpu1.54(TDO/TDI) JP1.6
TMS: cpu1.56(TMS) JP1.4
NetADP1_4: ADP1.4(BYP) C3.1
NetADP1_5: ADP1.5(OUT) C2.1 R3.2 R4.2
NetC5_2: C5.2 cpu1.53(XT2IN) JP2.1
NetC6_2: C6.2 cpu1.52(XT2OUT) JP2.3
NetLED10_1: LED10.1(A) R60.1

Not connected (* = marked no-connect by the designer): cpu1 7(NC) 8(XIN) 9(XOUT/TCLK) 10(NC) 11(NC); JP2 2; P1 23 26 29

### Notes on the sheet
- 此处将header12*2  替换成header14*2，并加入5个net
  20

### Library data of the parts
ADP1 = ADP1711_3v3
C1-C10 C12 C13 = Cap Semi: Capacitor (Semiconductor SIM Model); Published: 8-Jun-2000; Revision: July-2002: Re-released for DXP Platform.; Publisher: Altium Limited
  C4 C9 C13: Value: 0.1uF
  C5 C6: Value: 15p
  C7 C10 C12: Value: 10uF
cpu1 = MSP430F149
DS1 LED10 = LED3: Typical BLUE SiC LED; Revision 1: Jul-2002: Re-released for DXP Platform.; Revision 2: 17-Dec-2003: PCB Footprint replaced.; Published: 8-Jun-2000; Publisher: Altium Limited
JP1 = Header 6: Header, 6-Pin; LatestRevisionDate: 17-Jul-2002; LatestRevisionNote: Re-released for DXP Platform.; Publisher: Altium Limited
JP2 JP6 = Header 3: Header, 3-Pin; Revision: 17-Jul-2002: Re-released for DXP Platform.; Publisher: Altium Limited
P1 = Header 17X2: Header, 17-Pin, Dual row; LatestRevisionDate: 17-Jul-2002; LatestRevisionNote: Re-released for DXP Platform.; Publisher: Altium Limited
P2 P3 = Header 2: Header, 2-Pin; LatestRevisionDate: 17-Jul-2002; LatestRevisionNote: Re-released for DXP Platform.; Publisher: Altium Limited
R1 R60 = Res3: Resistor; Published: 8-Jun-2000; Revision: July-2002: Re-released for DXP Platform.; Publisher: Altium Limited
  R1: Value: 100K
  R60: Value: 2K
R3 R4 = Res Semi: Semiconductor Resistor; Published: 8-Jun-2000; LatestRevisionDate: 17-Jul-2002; LatestRevisionNote: Re-released for DXP Platform.; PackageReference: AXIAL-0.5; Publisher: Altium Limited; Value: 1
R5 R6 = Res2: Resistor; Value: 1K; Published: 8-Jun-2000; Revision: July-2002: Re-released for DXP Platform.; Publisher: Altium Limited

## Sheet Li_Monitor.SchDoc
size A
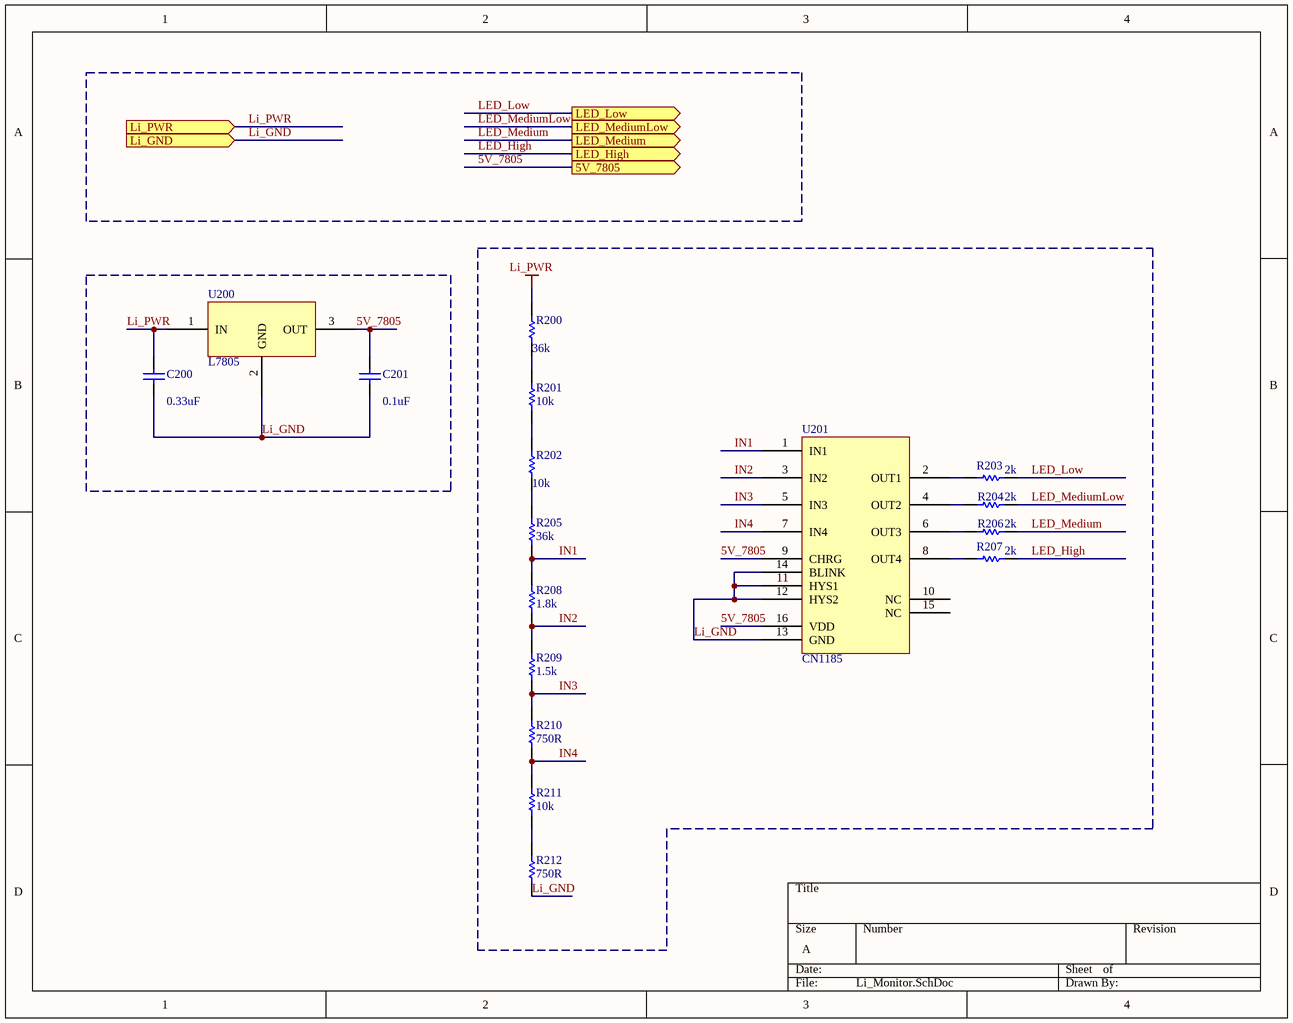
[diagram p5: Li_Monitor.SchDoc]

### Parts
C200  0.33uF  [cap0603]
C201  0.1uF  [cap0603]
R200  36k  [RES0603]
R201  10k  [RES0603]
R202  10k  [RES0603]
R203  2k  [RES0603]
R204  2k  [RES0603]
R205  36k  [RES0603]
R206  2k  [RES0603]
R207  2k  [RES0603]
R208  1.8k  [RES0603]
R209  1.5k  [RES0603]
R210  750R  [RES0603]
R211  10k  [RES0603]
R212  750R  [RES0603]
U200  L7805  [TO-220-AB]
U201  CN1185  [SSOP16_L]

### Ports
5V_7805 (out), LED_High (out), LED_Low (out), LED_Medium (out), LED_MediumLow (out), Li_GND (in), Li_PWR (in)

### Nets
Li_GND: C200.1 C201.1 R212.1 U200.2(GND) U201.11(HYS1) U201.12(HYS2) U201.13(GND) U201.14(BLINK) ; port Li_GND  [project net GND]
Li_PWR: C200.2 R200.2 U200.1(IN) ; port Li_PWR  [project net IN_+12V]
5V_7805: C201.2 U200.3(OUT) U201.9(CHRG) U201.16(VDD) ; port 5V_7805
IN1: R205.1 R208.2 U201.1(IN1)
IN2: R208.1 R209.2 U201.3(IN2)
IN3: R209.1 R210.2 U201.5(IN3)
IN4: R210.1 R211.2 U201.7(IN4)
LED_High: R207.2 ; port LED_High
LED_Low: R203.2 ; port LED_Low
LED_Medium: R206.2 ; port LED_Medium
LED_MediumLow: R204.2 ; port LED_MediumLow
NetR200_1: R200.1 R201.2
NetR201_1: R201.1 R202.2
NetR202_1: R202.1 R205.2
NetR203_1: R203.1 U201.2(OUT1)
NetR204_1: R204.1 U201.4(OUT2)
NetR206_1: R206.1 U201.6(OUT3)
NetR207_1: R207.1 U201.8(OUT4)
NetR211_1: R211.1 R212.2

Not connected (* = marked no-connect by the designer): U201 10(NC) 15(NC)

### Library data of the parts
C200 C201 = Cap: Capacitor; Published: 8-Jun-2000; LatestRevisionDate: 17-Jul-2002; LatestRevisionNote: Re-released for DXP Platform.; PackageReference: RAD-0.3; Publisher: Altium Limited; PackageDescription: Radial Cap, Thru-Hole; 2 Leads; 0.3 in Pin Spacing
  C200: Value: 0.33uF
  C201: Value: 0.1uF
R200-R202 R205 R208-R212 = Res1: Resistor; Published: 8-Jun-2000; LatestRevisionDate: 17-Jul-2002; LatestRevisionNote: Re-released for DXP Platform.; PackageReference: AXIAL-0.3; Publisher: Altium Limited; PackageDescription: Axial Device, Thru-Hole; 2 Leads; 0.3 in Pin Spacing
  R200 R205: Value: 36k
  R201 R202 R211: Value: 10k
  R208: Value: 1.8k
  R209: Value: 1.5k
  R210 R212: Value: 750R
R203 R204 R206 R207 = Res1: Resistor; Value: 10k; Published: 8-Jun-2000; LatestRevisionDate: 17-Jul-2002; LatestRevisionNote: Re-released for DXP Platform.; PackageReference: AXIAL-0.3; Publisher: Altium Limited; PackageDescription: Axial Device, Thru-Hole; 2 Leads; 0.3 in Pin Spacing

## Nets that join several sheets
3.3V: 输出板 (R2.1 R7.2 R21.1 R22.2), 高压刺激电路 (24 pins), ADC_USB (P1.28)
A3V3: 输出板 (R8.1 R19.1), ADC_USB (C12.2 C13.2 cpu1.64 R3.1)
D3V3: 输出板 (R23.1 R24.1), ADC_USB (8 pins)
GND: 输出板 (DC12V_IN.2 P4.2 P5.3 POWER3.2), 电源 (9 pins), ADC_USB (15 pins), Li_Monitor (8 pins)
GND5V2: 输出板 (5 pins), 高压刺激电路 (36 pins), 电源 (DC-DC1.4 P_C2.2 P_C3.1), ADC_USB (P1.30)
GND60V: 输出板 (POWER2.2 POWER4.1 POWER4.2 POWER4.3), 高压刺激电路 (C28.2 C29.2 R20.2), 电源 (2.4 P_C4.2 P_C6.1)
IN_+12V: 输出板 (DC12V_IN.1 P5.5), 电源 (P_F1.1 P_F2.1 P_F3.1), Li_Monitor (C200.2 R200.2 U200.1)
VCC5V1: 输出板 (POWER3.1), 电源 (P_C8.1 P_L8.2), ADC_USB (P1.22 P1.24 R6.2 R60.2)
VCC5V2: 输出板 (POWER1.1), 高压刺激电路 (7 pins), 电源 (P_C2.1 P_L1.2)
VCC60V: 输出板 (POWER2.1), 高压刺激电路 (C28.1 R9.2 R10.2 U4.15), 电源 (P_C4.1 P_L5.2)
VEE5V2: 输出板 (POWER1.3), 高压刺激电路 (6 pins), 电源 (P_C3.2 P_L3.2)
VEE60V: 输出板 (POWER2.3), 高压刺激电路 (C29.1 R14.1 R15.1 U4.13), 电源 (P_C6.2 P_L6.2)
5V_7805: ADC_USB (P1.21), Li_Monitor (C201.2 U200.3 U201.9 U201.16)
16: 输出板 (U5#1.2), ADC_USB (cpu1.18 P1.13)
17: 输出板 (U5#1.4), ADC_USB (cpu1.19 P1.15)
66: 输出板 (U5#1.6), ADC_USB (cpu1.5 P3.1)
67: 输出板 (U5#1.8), ADC_USB (cpu1.6 P3.2)
AD1: 高压刺激电路 (U3.15), ADC_USB (P1.31)
AD2: 高压刺激电路 (U3.16), ADC_USB (P1.33)
E1_AMP: 输出板 (R21.2 U5#1.16), 高压刺激电路 (U3.81)
E2_AMP: 输出板 (R22.1 U5#1.14), 高压刺激电路 (U3.82)
INPUT_IN1: 输出板 (R2.2 U5#1.12), 高压刺激电路 (U3.23)
INPUT_IN2: 输出板 (R7.1 U5#1.10), 高压刺激电路 (U3.24)
LED_High: ADC_USB (P1.17), Li_Monitor (R207.2)
LED_Low: ADC_USB (P1.20), Li_Monitor (R203.2)
LED_Medium: ADC_USB (P1.18), Li_Monitor (R206.2)
LED_MediumLow: ADC_USB (P1.19), Li_Monitor (R204.2)
OUT1+: 高压刺激电路 (U4.3 U4.45), ADC_USB (P1.25)
OUT1-: 高压刺激电路 (U4.46 U4.48), ADC_USB (P1.27)
OUT2+: 高压刺激电路 (U4.40 U4.44), ADC_USB (P1.34)
OUT2-: 高压刺激电路 (U4.39 U4.41), ADC_USB (P1.32)
VEE5V1: 输出板 (POWER3.3), 电源 (P_C9.2 P_L9.2)